# Altium project PhaseDetection-V1.PrjPcb
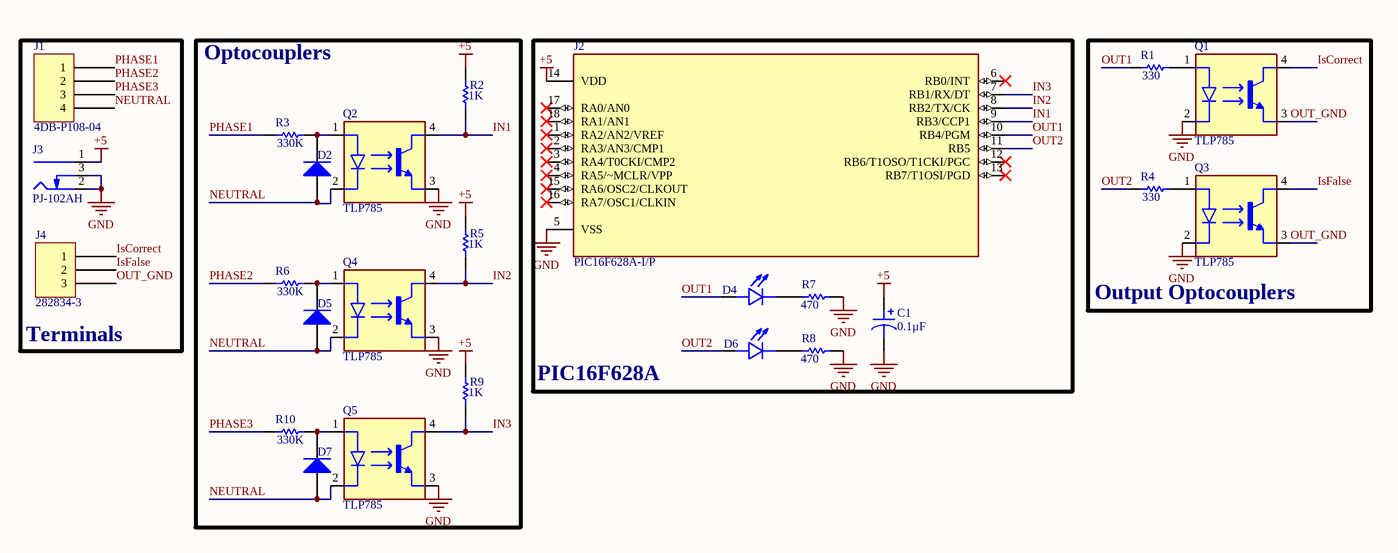
[diagram p0: Sheet1.SchDoc]
1 sheet, 25 parts. Net scope: global (net labels, ports and power ports of the same name join across sheets).
Board file: PCB1.PcbDoc

## Sheet Sheet1.SchDoc
size A4; SheetNumber: 1; SheetTotal: 1; SPICEModelCacheNMFAOAMN: <root> / <DocumentId>NMFAOAMN</DocumentId> / <CacheFrame Number="0"> / <Model Name="1n4007" Kind="MDL"> / <Text>*1N4007 MCE 8-16-95 / *1000V 1A Si GenPurpose Diode pkg:DIODE0.4 1,2 / .MODEL 1N4007 D(IS=2.55E-9 RS=0.042 N=1.75 TT=5.76E-6 CJO=1.85E-11 / + VJ=0.75 M=0.333 BV=1000 IBV=9.86E-5 )</Text> / </Model> / </CacheFrame> / </root>

### Parts
C1  0.1µF  [CAP TH ALUM ELEC D5.00mm S2.00mm H12.00mm]
D2  Diode 1N4007  [DO-41]  (value not drawn)
D4  HLMP-4719-A00B2  [LEDRD254W47D584H1078]  (value not drawn)
D5  Diode 1N4007  [DO-41]  (value not drawn)
D6  HLMP-4719-A00B2  [LEDRD254W47D584H1078]  (value not drawn)
D7  Diode 1N4007  [DO-41]  (value not drawn)
J1  4DB-P108-04  [TE 4DB-P108-04]
J2  PIC16F628A-I/P  [DIP254P762X533-18]
J3  PJ-102AH  [CUI PJ-102AH]
J4  282834-3  [TE 282834-3]
Q1  TLP785  [DIP762W50P254L460H425Q4]
Q2  TLP785  [DIP762W50P254L460H425Q4]
Q3  TLP785  [DIP762W50P254L460H425Q4]
Q4  TLP785  [DIP762W50P254L460H425Q4]
Q5  TLP785  [DIP762W50P254L460H425Q4]
R1  value 330  [AXIAL-0.3]  (hidden comment: Res1)
R2  value 1K  [AXIAL-0.3]  (hidden comment: Res1)
R3  value 330K  [AXIAL-0.3]  (hidden comment: Res1)
R4  value 330  [AXIAL-0.3]  (hidden comment: Res1)
R5  value 1K  [AXIAL-0.3]  (hidden comment: Res1)
R6  value 330K  [AXIAL-0.3]  (hidden comment: Res1)
R7  value 470  [AXIAL-0.3]  (hidden comment: Res1)
R8  value 470  [AXIAL-0.3]  (hidden comment: Res1)
R9  value 1K  [AXIAL-0.3]  (hidden comment: Res1)
R10  value 330K  [AXIAL-0.3]  (hidden comment: Res1)

### Blocks framed on the sheet
Terminals: J1 J3 J4
Optocouplers: D2 D5 D7 Q2 Q4 Q5 R2 R3 R5 R6 R9 R10
PIC16F628A: C1 D4 D6 J2 R7 R8
Output Optocouplers: Q1 Q3 R1 R4

### Nets
+5: C1.1 J2.14(VDD) J3.1(Centre) R2.2 R5.2 R9.2
GND: C1.2 J2.5(VSS) J3.2(Outer) J3.3(SW) Q1.2(CATHODE) Q2.3(EMITTER) Q3.2(CATHODE) Q4.3(EMITTER) Q5.3(EMITTER) R7.1 R8.1
IN1: J2.9(RB3/CCP1) Q2.4(COLLECTOR) R2.1
IN2: J2.8(RB2/TX/CK) Q4.4(COLLECTOR) R5.1
IN3: J2.7(RB1/RX/DT) Q5.4(COLLECTOR) R9.1
IsCorrect: J4.1 Q1.4(COLLECTOR)
IsFalse: J4.2 Q3.4(COLLECTOR)
NEUTRAL: D2.1(A) D5.1(A) D7.1(A) J1.4 Q2.2(CATHODE) Q4.2(CATHODE) Q5.2(CATHODE)
OUT1: D4.2(A) J2.10(RB4/PGM) R1.1
OUT2: D6.2(A) J2.11(RB5) R4.1
OUT_GND: J4.3 Q1.3(EMITTER) Q3.3(EMITTER)
PHASE1: J1.1 R3.1
PHASE2: J1.2 R6.1
PHASE3: J1.3 R10.1
NetD2_2: D2.2(K) Q2.1(ANODE) R3.2
NetD4_1: D4.1(C) R7.2
NetD5_2: D5.2(K) Q4.1(ANODE) R6.2
NetD6_1: D6.1(C) R8.2
NetD7_2: D7.2(K) Q5.1(ANODE) R10.2
NetQ1_1: Q1.1(ANODE) R1.2
NetQ3_1: Q3.1(ANODE) R4.2

Not connected (* = marked no-connect by the designer): J2 1(RA2/AN2/VREF)* 2(RA3/AN3/CMP1)* 3(RA4/T0CKI/CMP2)* 4(RA5/~MCLR/VPP)* 6(RB0/INT)* 12(RB6/T1OSO/T1CKI/PGC)* 13(RB7/T1OSI/PGD)* 15(RA6/OSC2/CLKOUT)* 16(RA7/OSC1/CLKIN)* 17(RA0/AN0)* 18(RA1/AN1)*

### Library data of the parts
C1 = UKL2A0R1KDD: CAP ALUM 0.1UF 10% 100V RADIAL; manufacturer: Nichicon; Lifetime @ Temp.: 2000 Hrs @ 85°C; Polarization: Polar; Ripple Current @ High Frequency: 4.2mA @ 10kHz; Ripple Current @ Low Frequency: 2.1mA @ 120Hz; Part Number: UKL2A0R1KDD; Applications: General Purpose; Capacitance: 0.1µF; componentlink1description: Datasheet; componentlink1url: http://nichicon-us.com/english/products/pdfs/e-ukl.pdf; componentlink2description: DigiKey Link; componentlink2url: http://digikey.com/product-detail/en/nichicon/UKL2A0R1KDD/493-16876-ND/2598554; Device Package: Radial, Can; Height - Seated (Max): 0.472" (12.00mm); lastupdated: 9/4/2020 11:28:57 PM; Lead Spacing: 0.079" (2.00mm); Lifecycle Status: Active; Minimum Order: 1; Mounting Type: Through Hole; Operating Temperature: -40°C ~ 85°C; Package / Case: Radial, Can; packaging: Bulk; partid: 21583; Part Status: Active; price: 0.39; series: UKL; Size / Dimension: 0.197" Dia (5.00mm); Supplier 1: DigiKey; Supplier Part Number 1: 493-16876-ND; Tolerance: ±10%; value: 0.1µF; Voltage - Rated: 100V
D2 D5 D7 = Diode 1N4007: 1 Amp General Purpose Rectifier; Published: 8-Jun-2000; LatestRevisionDate: 17-Jul-2002; LatestRevisionNote: Re-released for DXP Platform.; DatasheetVersion: 1998; PackageVersion: Aug-1999; PackageReference: DO-41; Publisher: Altium Limited; PackageDescription: Diode, Axial; Body 5.2 x 2.7 mm (LxDia. max), Lead Dia. 0.86 mm (max); Code_JEDEC: DO-204-AL; ComponentLink1Description: Manufacturer Link; ComponentLink1URL: http://www.fairchildsemi.com/; ComponentLink2Description: Datasheet; ComponentLink2URL: http://www.fairchildsemi.com/ds/1N%2F1N4001.pdf
D4 D6 = HLMP-4719-A00B2: Yellow 5mm LED LOW CURRENT 2mA R/A T/L; MF: Avago; SnapEDA_Link: https://www.snapeda.com/parts/HLMP-4719-A00B2/Avago/view-part/?ref=snap; Package: None; Value: *; MP: HLMP-4719-A00B2; Check_prices: https://www.snapeda.com/parts/HLMP-4719-A00B2/Avago/view-part/?ref=eda
J1 = 4DB-P108-04: CONN BARRIER STRIP 4CIRC 0.325"; Manufacturer: TE Connectivity AMP Connectors; Barrier Type: 2 Wall (Dual); Bottom Termination: PC Pin; Current Rating (Amps): 20A; Number of Circuits: 4; Pitch: 0.325" (8.26mm); Top Termination: Screws with Captive Plate; Voltage Rating: 150V; Wire Gauge: 12-22 AWG; Part Number: 4DB-P108-04; Color: Black; ComponentLink1Description: Datasheet; ComponentLink1URL: https://www.te.com/commerce/DocumentDelivery/DDEController?Action=srchrtrv&DocNm=2-1437667-4&DocType=Customer+Drawing&DocLang=English; ComponentLink2Description: DigiKey Link; ComponentLink2URL: http://digikey.com/product-detail/en/te-connectivity-amp-connectors/4DB-P108-04/A98474-ND/1277922; LastUpdated: 1/15/2020 4:13:12 AM; Lifecycle Status: Active; Minimum Order: 1; Number of Rows: 1; Number of Wire Entries: 4; Packaging: Bulk; Part Status: Active; Price: 2.22; Series: 4DB, Buchanan; Supplier 1: DigiKey; Supplier Part Number 1: A98474-ND; Terminal Block Type: Barrier Block
J2 = PIC16F628A-I/P: 18-Pin 3.5 KB Flash 224 RAM 16 I/O, PIC 16F Series | Microchip Technology Inc. PIC16F628A-I/P; SnapEDA_Link: https://www.snapeda.com/parts/PIC16F628A-I/P/Microchip/view-part/?ref=snap; Package: DIP-18 Microchip; Value: *; MF: Microchip; MP: PIC16F628A-I/P; Check_prices: https://www.snapeda.com/parts/PIC16F628A-I/P/Microchip/view-part/?ref=eda
J3 = PJ-102AH: CONN PWR JACK 2X5.5MM SOLDER; Manufacturer: CUI Devices; Actual Diameter: 0.079" (2.00mm ID), 0.256" (6.50mm OD); Current Rating (Amps): 5A; Gender: Male; Industry Recognized Mating Diameter: 2.00mm ID (0.079"), 5.50mm OD (0.217"); Internal Switch(s): Single Switch, Normally Closed; Material Flammability Rating: UL94 V-0; Mating Length/Depth: 0.354" (9.00mm); Number of Positions/Contacts: 2 Conductors, 3 Contacts; Shielding: Unshielded; Voltage - Rated: 24VDC; Part Number: PJ-102AH; ComponentLink1Description: Datasheet; ComponentLink1URL: https://www.cuidevices.com/product/resource/digikeypdf/pj-102ah.pdf; ComponentLink2Description: DigiKey Link; ComponentLink2URL: //digikey.com/product-detail/en/cui-devices/PJ-102AH/CP-102AH-ND/408448; Connector Type: Jack; LastUpdated: 12/16/2019 7:01:27 PM; Lifecycle Status: 0; Minimum Order: 1; Mounting Type: Through Hole, Right Angle; Packaging: Tray; Part Status: Active; Price: 0.76; Series: -; Supplier 1: DigiKey; Supplier Part Number 1: CP-102AH-ND; Termination: Solder
J4 = 282834-3: TERM BLK 3P SIDE ENT 2.54MM PCB; Manufacturer: TE Connectivity AMP Connectors; Current: 10A; Mating Orientation: Horizontal with Board; Number of Levels: 1; Pitch: 0.100" (2.54mm); Positions Per Level: 3; Voltage: 150V; Wire Gauge: 16-30 AWG; Wire Termination: Screw - Rising Cage Clamp; Part Number: 282834-3; Color: Green; ComponentLink1Description: Datasheet; ComponentLink1URL: https://www.te.com/commerce/DocumentDelivery/DDEController?Action=srchrtrv&DocNm=282834&DocType=Customer+Drawing&DocLang=English; ComponentLink2Description: DigiKey Link; ComponentLink2URL: http://digikey.com/product-detail/en/te-connectivity-amp-connectors/282834-3/A98334-ND/1153264; LastUpdated: 1/15/2020 4:15:50 AM; Lifecycle Status: Active; Minimum Order: 1; Mounting Type: Through Hole; Packaging: Bulk; Part Status: Active; Price: 2.01; Series: Buchanan; Supplier 1: DigiKey; Supplier Part Number 1: A98334-ND
Q1-Q5 = TLP785: Optoisolator Transistor Output 5000Vrms 1 Channel 4-DIP; MF: Toshiba; SnapEDA_Link: https://www.snapeda.com/parts/TLP785/Toshiba/view-part/?ref=snap; Package: SMD-4 Toshiba; Value: *; MP: TLP785; Check_prices: https://www.snapeda.com/parts/TLP785/Toshiba/view-part/?ref=eda
R1-R10 = Res1: Resistor; Published: 8-Jun-2000; LatestRevisionDate: 17-Jul-2002; LatestRevisionNote: Re-released for DXP Platform.; PackageReference: AXIAL-0.3; Publisher: Altium Limited; PackageDescription: Axial Device, Thru-Hole; 2 Leads; 0.3 in Pin Spacing